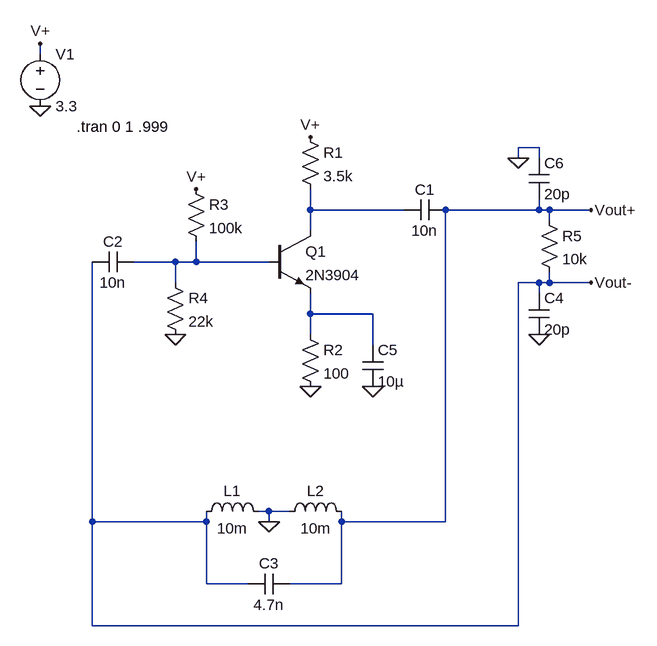
[diagram p0: schematic 06A-10.asc]
06A-10.asc, the LTspice schematic file:
Version 4.1
SHEET 1 880 756
WIRE -144 -128 -144 -144
WIRE 624 16 592 16
WIRE 592 32 592 16
WIRE 624 32 624 16
WIRE 272 112 272 80
WIRE 416 112 272 112
WIRE 624 112 624 96
WIRE 624 112 480 112
WIRE 640 112 624 112
WIRE 704 112 640 112
WIRE 640 128 640 112
WIRE 272 144 272 112
WIRE 64 192 0 192
WIRE 96 192 96 160
WIRE 96 192 64 192
WIRE 208 192 96 192
WIRE 64 224 64 192
WIRE 624 224 592 224
WIRE 640 224 640 208
WIRE 640 224 624 224
WIRE 704 224 640 224
WIRE 624 240 624 224
WIRE 272 272 272 240
WIRE 368 272 272 272
WIRE 272 304 272 272
WIRE 368 320 368 272
WIRE 208 576 192 576
WIRE 240 576 208 576
WIRE -64 592 -64 192
WIRE 112 592 112 576
WIRE 112 592 -64 592
WIRE 208 592 208 576
WIRE 320 592 320 576
WIRE 480 592 480 112
WIRE 480 592 320 592
WIRE 112 688 112 592
WIRE 176 688 112 688
WIRE 320 688 320 592
WIRE 320 688 240 688
WIRE -64 752 -64 592
WIRE 592 752 592 224
WIRE 592 752 -64 752
FLAG 208 592 0
FLAG 272 384 0
FLAG 64 304 0
FLAG 96 80 V+
FLAG 272 0 V+
FLAG 368 384 0
FLAG 704 112 Vout+
FLAG 704 224 Vout-
FLAG -144 -48 0
FLAG -144 -144 V+
FLAG 592 32 0
FLAG 624 304 0
SYMBOL npn 208 144 R0
SYMATTR InstName Q1
SYMATTR Value 2N3904
SYMBOL res 256 -16 R0
SYMATTR InstName R1
SYMATTR Value 3.5k
SYMBOL res 256 288 R0
SYMATTR InstName R2
SYMATTR Value 100
SYMBOL res 80 64 R0
SYMATTR InstName R3
SYMATTR Value 100k
SYMBOL res 48 208 R0
SYMATTR InstName R4
SYMATTR Value 22k
SYMBOL cap 480 96 R90
WINDOW 0 0 32 VBottom 2
WINDOW 3 32 32 VTop 2
SYMATTR InstName C1
SYMATTR Value 10n
SYMBOL cap 0 176 R90
WINDOW 0 0 32 VBottom 2
WINDOW 3 32 32 VTop 2
SYMATTR InstName C2
SYMATTR Value 10n
SYMBOL cap 352 320 R0
SYMATTR InstName C5
SYMATTR Value 10µ
SYMBOL voltage -144 -144 R0
WINDOW 123 0 0 Left 0
WINDOW 39 0 0 Left 0
SYMATTR InstName V1
SYMATTR Value 3.3
SYMBOL ind 96 592 R270
WINDOW 0 32 56 VTop 2
WINDOW 3 5 56 VBottom 2
SYMATTR InstName L1
SYMATTR Value 10m
SYMBOL ind 224 592 R270
WINDOW 0 32 56 VTop 2
WINDOW 3 5 56 VBottom 2
SYMATTR InstName L2
SYMATTR Value 10m
SYMBOL cap 240 672 R90
WINDOW 0 0 32 VBottom 2
WINDOW 3 32 32 VTop 2
SYMATTR InstName C3
SYMATTR Value 4.7n
SYMBOL res 624 112 R0
SYMATTR InstName R5
SYMATTR Value 10k
SYMBOL cap 608 240 R0
SYMATTR InstName C4
SYMATTR Value 20p
SYMBOL cap 608 32 R0
SYMATTR InstName C6
SYMATTR Value 20p
TEXT -88 -16 Left 2 !.tran 0 1 .999

The netlist it stands for:
* 06A-10.asc
Q1 N001 N002 N003 0 2N3904
R1 V+ N001 3.5k
R2 N003 0 100
R3 V+ N002 100k
R4 N002 0 22k
C1 Vout+ N001 10n
C2 N002 Vout- 10n
C5 N003 0 10µ
V1 V+ 0 3.3
L1 Vout- 0 10m
L2 0 Vout+ 10m
C3 Vout+ Vout- 4.7n
R5 Vout+ Vout- 10k
C4 Vout- 0 20p
C6 0 Vout+ 20p
.model NPN NPN
.model PNP PNP
.lib standard.bjt
.tran 0 1 .999
.backanno
.end